# EAGLE design bbb_localization_cape (EAGLE 8.4.2)

## Sheet 1 of 3: Main
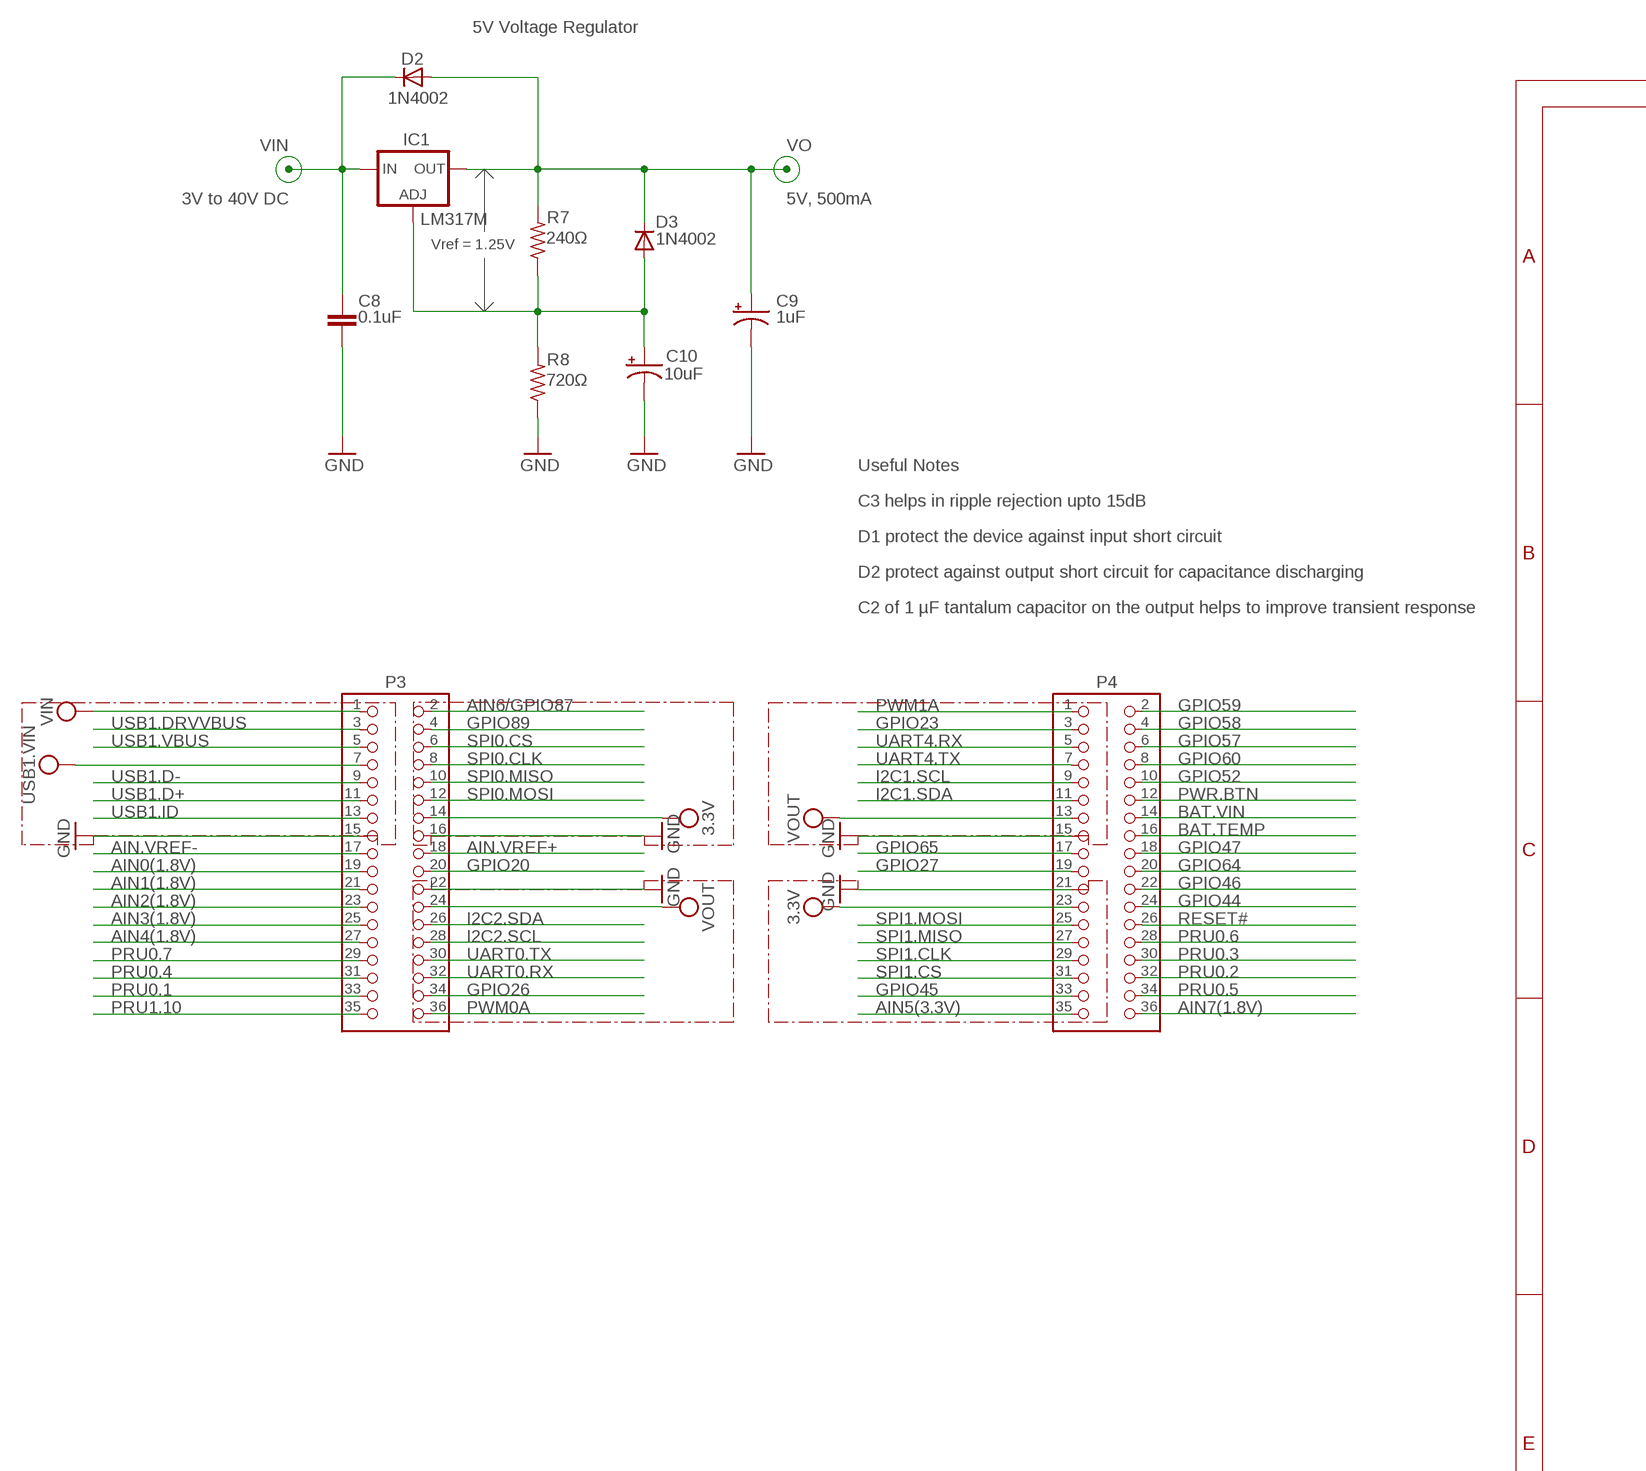
[diagram p0: schematic, sheet 1, part 1 of 2]
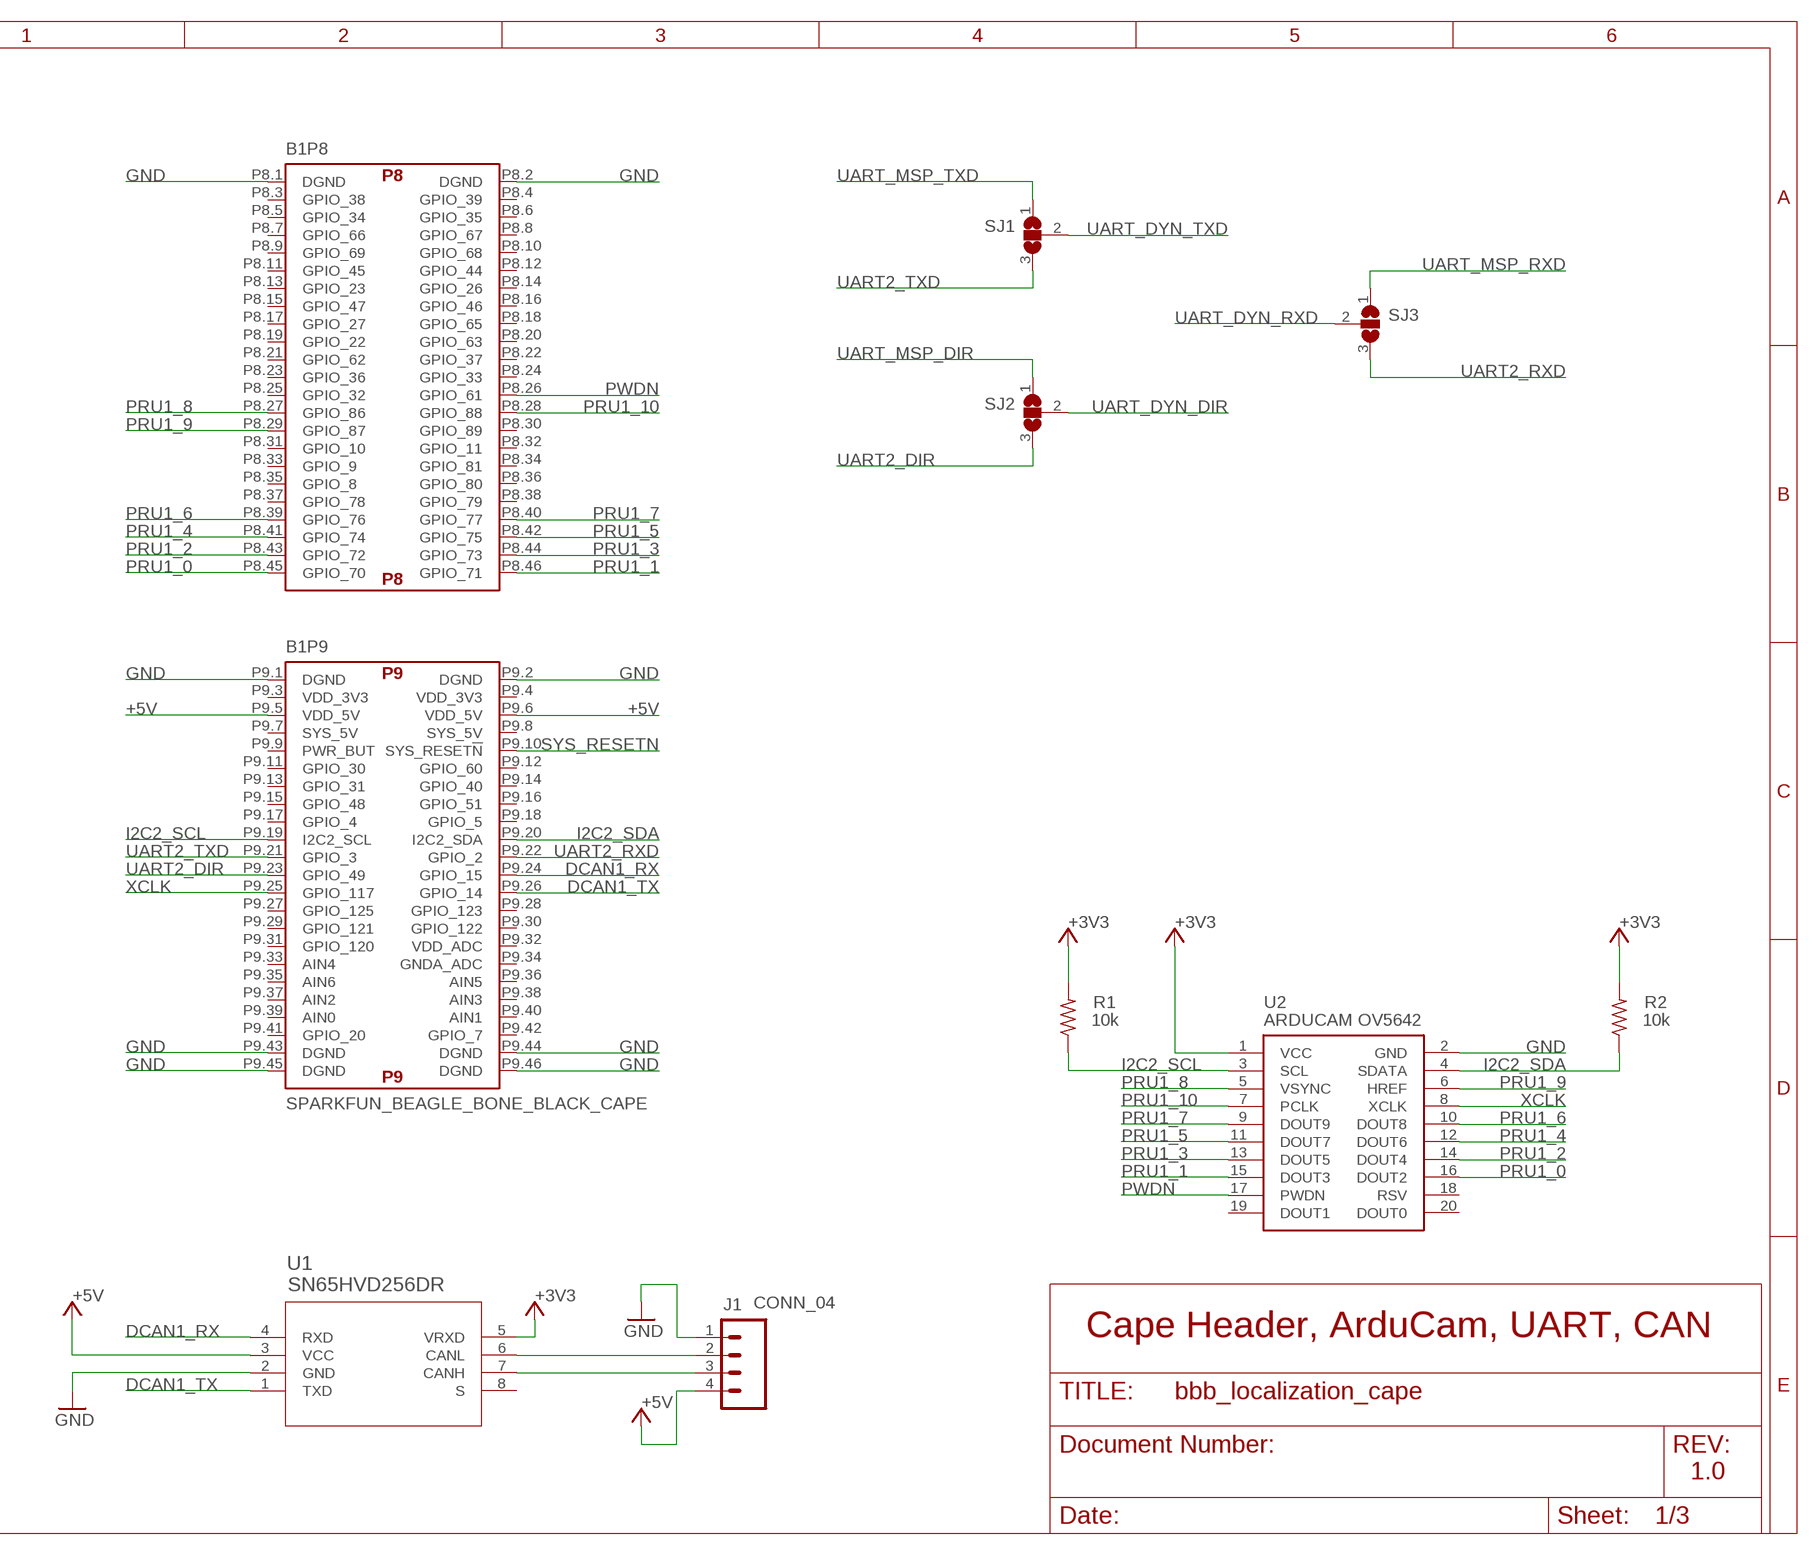
[diagram p1: schematic, sheet 1, part 2 of 2]

### Parts
B1  SPARKFUN_BEAGLE_BONE_BLACK_CAPE  [BEAGLE_BONE_BLACK_CAPE]
C8  0.1uF  C-EU075-052X106  [C075-052X106]
C9  1uF  CPOL-US085CS-1AR  [085CS_1AR]
C10  10uF  CPOL-US085CS-1AR  [085CS_1AR]
D2  1N4002  1N4004  [DO41-10]
D3  1N4002  1N4004  [DO41-10]
IC1  LM317MBSTT3  [SOT223]
J1  CONN_04  [JST-4-PTH-VERT]
P3  2X18-(INCH)-0.1-TH-(35MIL-DIA)-W/O-SILK  [TH-2X18-(35MIL-DIA)-W/O-SILK]
P4  2X18-(INCH)-0.1-TH-(35MIL-DIA)-W/O-SILK  [TH-2X18-(35MIL-DIA)-W/O-SILK]
R1  10k  R-US_R0805  [R0805]
R2  10k  R-US_R0805  [R0805]
R7  240Ω  R-US_M0805  [M0805]
R8  720Ω  R-US_M0805  [M0805]
SJ1  SJ2W  [SJ_2]
SJ2  SJ2W  [SJ_2]
SJ3  SJ2W  [SJ_2]
U1  SN65HVD256DR  [D8]
U2  ARDUCAMOV5642  [ARDUCAM]

### Nets
3.3V: P3.14 P4.23
+3V3: R1.2 R2.2 U1.5(VRXD) U2.1(VCC) ; also sheet 2,3
+5V: B1.P9.5(P9:VDD_5V) B1.P9.6(P9:VDD_5V) J1.4 U1.3(VCC) ; also sheet 2,3
AIN0(1.8V): P3.19
AIN1(1.8V): P3.21
AIN2(1.8V): P3.23
AIN3(1.8V): P3.25
AIN4(1.8V): P3.27
AIN5(3.3V): P4.35
AIN6/GPIO87: P3.2
AIN7(1.8V): P4.36
AIN.VREF+: P3.18
AIN.VREF-: P3.17
BAT.TEMP: P4.16
BAT.VIN: P4.14
DCAN1_RX: B1.P9.24(P9:GPIO_15) U1.4(RXD)
DCAN1_TX: B1.P9.26(P9:GPIO_14) U1.1(TXD)
GND: B1.P8.1(P8:DGND) B1.P8.2(P8:DGND) B1.P9.1(P9:DGND) B1.P9.2(P9:DGND) B1.P9.43(P9:DGND) B1.P9.44(P9:DGND) B1.P9.45(P9:DGND) B1.P9.46(P9:DGND) C8.2 C9.- C10.- J1.1 P3.15 P3.16 P3.22 P4.15 P4.21 R8.1 U1.2(GND) U2.2(GND) ; also sheet 2,3
GPIO20: P3.20
GPIO23: P4.3
GPIO26: P3.34
GPIO27: P4.19
GPIO44: P4.24
GPIO45: P4.33
GPIO46: P4.22
GPIO47: P4.18
GPIO52: P4.10
GPIO57: P4.6
GPIO58: P4.4
GPIO59: P4.2
GPIO60: P4.8
GPIO64: P4.20
GPIO65: P4.17
GPIO89: P3.4
I2C1.SCL: P4.9
I2C1.SDA: P4.11
I2C2.SCL: P3.28
I2C2.SDA: P3.26
I2C2_SCL [power]: B1.P9.19(P9:I2C2_SCL) R1.1 U2.3(SCL) ; also sheet 2
I2C2_SDA: B1.P9.20(P9:I2C2_SDA) R2.1 U2.4(SDATA) ; also sheet 2
N$1: J1.2 U1.6(CANL)
N$2: J1.3 U1.7(CANH)
N$5: C10.+ D3.A IC1.1(ADJ) R7.1 R8.2
PRU0.1: P3.33
PRU0.2: P4.32
PRU0.3: P4.30
PRU0.4: P3.31
PRU0.5: P4.34
PRU0.6: P4.28
PRU0.7: P3.29
PRU1.10: P3.35
PRU1_0 [power]: B1.P8.45(P8:GPIO_70) U2.16(DOUT2)
PRU1_1 [power]: B1.P8.46(P8:GPIO_71) U2.15(DOUT3)
PRU1_2 [power]: B1.P8.43(P8:GPIO_72) U2.14(DOUT4)
PRU1_3 [power]: B1.P8.44(P8:GPIO_73) U2.13(DOUT5)
PRU1_4 [power]: B1.P8.41(P8:GPIO_74) U2.12(DOUT6)
PRU1_5 [power]: B1.P8.42(P8:GPIO_75) U2.11(DOUT7)
PRU1_6 [power]: B1.P8.39(P8:GPIO_76) U2.10(DOUT8)
PRU1_7 [power]: B1.P8.40(P8:GPIO_77) U2.9(DOUT9)
PRU1_8 [power]: B1.P8.27(P8:GPIO_86) U2.5(VSYNC)
PRU1_9 [power]: B1.P8.29(P8:GPIO_87) U2.6(HREF)
PRU1_10 [power]: B1.P8.28(P8:GPIO_88) U2.7(PCLK)
PWDN: B1.P8.26(P8:GPIO_61) U2.17(PWDN)
PWM0A: P3.36
PWM1A: P4.1
PWR.BTN: P4.12
RESET#: P4.26
SPI0.CLK: P3.8
SPI0.CS: P3.6
SPI0.MISO: P3.10
SPI0.MOSI: P3.12
SPI1.CLK: P4.29
SPI1.CS: P4.31
SPI1.MISO: P4.27
SPI1.MOSI: P4.25
SYS_RESETN: B1.P9.10(P9:SYS_RESET!N) ; also sheet 3
UART0.RX: P3.32
UART0.TX: P3.30
UART2_DIR: B1.P9.23(P9:GPIO_49) SJ2.3
UART2_RXD: B1.P9.22(P9:GPIO_2) SJ3.3
UART2_TXD: B1.P9.21(P9:GPIO_3) SJ1.3
UART4.RX: P4.5
UART4.TX: P4.7
UART_DYN_DIR: SJ2.2 ; also sheet 2
UART_DYN_RXD: SJ3.2 ; also sheet 2
UART_DYN_TXD: SJ1.2 ; also sheet 2
UART_MSP_DIR: SJ2.1 ; also sheet 2
UART_MSP_RXD: SJ3.1 ; also sheet 2
UART_MSP_TXD: SJ1.1 ; also sheet 2
USB1.D+: P3.11
USB1.D-: P3.9
USB1.DRVVBUS: P3.3
USB1.ID: P3.13
USB1.VBUS: P3.5
VIN: C8.1 D2.C IC1.3(IN) P3.1
VIN.USB: P3.7 ; supply symbol labelled USB1.VIN
VO: C9.+ D2.A D3.C IC1.4(OUT) R7.2
VOUT: P3.24 P4.13
XCLK: B1.P9.25(P9:GPIO_117) U2.8(XCLK)
Unconnected: B1.P8.3(P8:GPIO_38) B1.P8.4(P8:GPIO_39) B1.P8.5(P8:GPIO_34) B1.P8.6(P8:GPIO_35) B1.P8.7(P8:GPIO_66) B1.P8.8(P8:GPIO_67) B1.P8.9(P8:GPIO_69) B1.P8.10(P8:GPIO_68) B1.P8.11(P8:GPIO_45) B1.P8.12(P8:GPIO_44) B1.P8.13(P8:GPIO_23) B1.P8.14(P8:GPIO_26) B1.P8.15(P8:GPIO_47) B1.P8.16(P8:GPIO_46) B1.P8.17(P8:GPIO_27) B1.P8.18(P8:GPIO_65) B1.P8.19(P8:GPIO_22) B1.P8.20(P8:GPIO_63) B1.P8.21(P8:GPIO_62) B1.P8.22(P8:GPIO_37) B1.P8.23(P8:GPIO_36) B1.P8.24(P8:GPIO_33) B1.P8.25(P8:GPIO_32) B1.P8.30(P8:GPIO_89) B1.P8.31(P8:GPIO_10) B1.P8.32(P8:GPIO_11) B1.P8.33(P8:GPIO_9) B1.P8.34(P8:GPIO_81) B1.P8.35(P8:GPIO_8) B1.P8.36(P8:GPIO_80) B1.P8.37(P8:GPIO_78) B1.P8.38(P8:GPIO_79) B1.P9.3(P9:VDD_3V3) B1.P9.4(P9:VDD_3V3) B1.P9.7(P9:SYS_5V) B1.P9.8(P9:SYS_5V) B1.P9.9(P9:PWR_BUT) B1.P9.11(P9:GPIO_30) B1.P9.12(P9:GPIO_60) B1.P9.13(P9:GPIO_31) B1.P9.14(P9:GPIO_40) B1.P9.15(P9:GPIO_48) B1.P9.16(P9:GPIO_51) B1.P9.17(P9:GPIO_4) B1.P9.18(P9:GPIO_5) B1.P9.27(P9:GPIO_125) B1.P9.28(P9:GPIO_123) B1.P9.29(P9:GPIO_121) B1.P9.30(P9:GPIO_122) B1.P9.31(P9:GPIO_120) B1.P9.32(P9:VDD_ADC) B1.P9.33(P9:AIN4) B1.P9.34(P9:GNDA_ADC) B1.P9.35(P9:AIN6) B1.P9.36(P9:AIN5) B1.P9.37(P9:AIN2) B1.P9.38(P9:AIN3) B1.P9.39(P9:AIN0) B1.P9.40(P9:AIN1) B1.P9.41(P9:GPIO_20) B1.P9.42(P9:GPIO_7) U1.8(S) U2.18(RSV) U2.19(DOUT1) U2.20(DOUT0)

### Notes on the sheet
- 5V Voltage Regulator
- 3V to 40V DC | 5V, 500mA
- Vref = 1.25V
- Useful Notes
- C3 helps in ripple rejection upto 15dB
- D1 protect the device against input short circuit
- D2 protect against output short circuit for capacitance discharging
- C2 of 1 µF tantalum capacitor on the output helps to improve transient response
- Cape Header, ArduCam, UART, CAN
- 1.0

## Sheet 2 of 3: MSP430
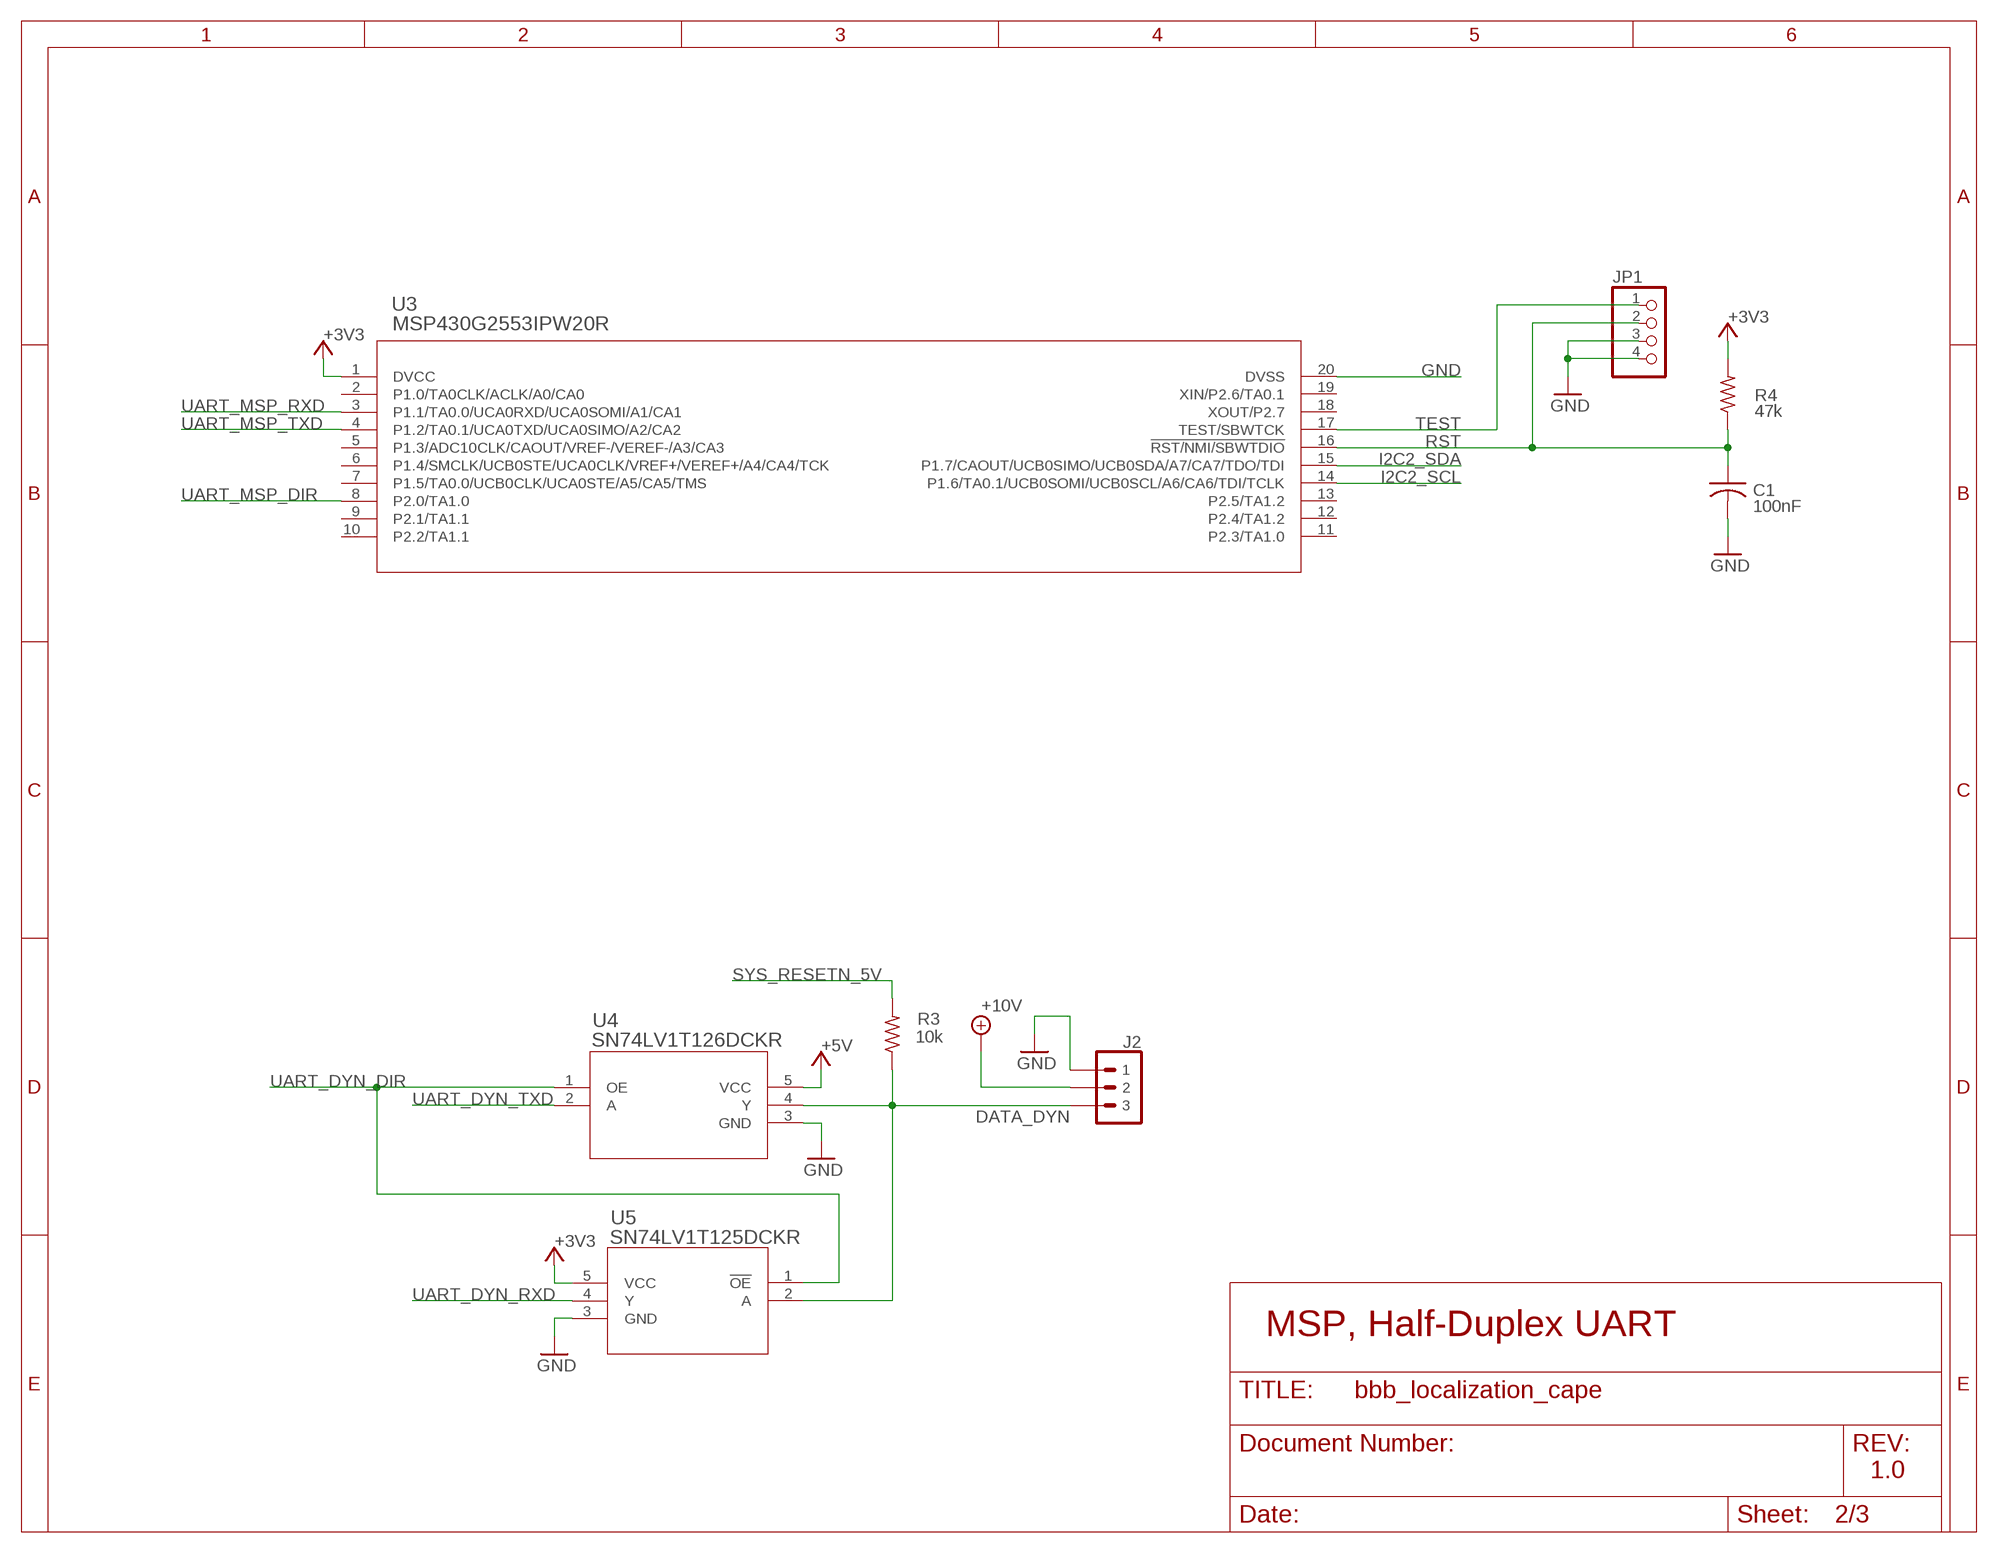
[diagram p2: schematic, sheet 2]

### Parts
C1  100nF  C-USC0805  [C0805]
J2  MOLEX-22-03-5035  [MOLEX-22-03-5035]
JP1  PINHD-1X4  [1X04]
R3  10k  R-US_R0805  [R0805]
R4  47k  R-US_R0805  [R0805]
U3  MSP430G2553IPW20R  [PW20]
U4  SN74LV1T126DCKR  [DCK5]
U5  SN74LV1T125DCKR  [DCK5]

### Nets
+3V3: R4.2 U3.1(DVCC) U5.5(VCC) ; also sheet 1,3
+5V: U4.5(VCC) ; also sheet 1,3
+10V: J2.P$2 ; also sheet 3
DATA_DYN: J2.P$3 R3.1 U4.4(Y) U5.2(A)
GND: C1.2 J2.P$1 JP1.3 JP1.4 U3.20(DVSS) U4.3(GND) U5.3(GND) ; also sheet 1,3
I2C2_SCL [power]: U3.14(P1.6/TA0.1/UCB0SOMI/UCB0SCL/A6/CA6/TDI/TCLK) ; also sheet 1
I2C2_SDA: U3.15(P1.7/CAOUT/UCB0SIMO/UCB0SDA/A7/CA7/TDO/TDI) ; also sheet 1
RST: C1.1 JP1.2 R4.1 U3.16(!RST/NMI/SBWTDIO)
SYS_RESETN_5V: R3.2 ; also sheet 3
TEST: JP1.1 U3.17(TEST/SBWTCK)
UART_DYN_DIR: U4.1(OE) U5.1(!OE) ; also sheet 1
UART_DYN_RXD: U5.4(Y) ; also sheet 1
UART_DYN_TXD: U4.2(A) ; also sheet 1
UART_MSP_DIR: U3.8(P2.0/TA1.0) ; also sheet 1
UART_MSP_RXD: U3.3(P1.1/TA0.0/UCA0RXD/UCA0SOMI/A1/CA1) ; also sheet 1
UART_MSP_TXD: U3.4(P1.2/TA0.1/UCA0TXD/UCA0SIMO/A2/CA2) ; also sheet 1
Unconnected: U3.2(P1.0/TA0CLK/ACLK/A0/CA0) U3.5(P1.3/ADC10CLK/CAOUT/VREF-/VEREF-/A3/CA3) U3.6(P1.4/SMCLK/UCB0STE/UCA0CLK/VREF+/VEREF+/A4/CA4/TCK) U3.7(P1.5/TA0.0/UCB0CLK/UCA0STE/A5/CA5/TMS) U3.9(P2.1/TA1.1) U3.10(P2.2/TA1.1) U3.11(P2.3/TA1.0) U3.12(P2.4/TA1.2) U3.13(P2.5/TA1.2) U3.18(XOUT/P2.7) U3.19(XIN/P2.6/TA0.1)

### Notes on the sheet
- MSP, Half-Duplex UART
- 1.0

## Sheet 3 of 3: DC/DC Converters
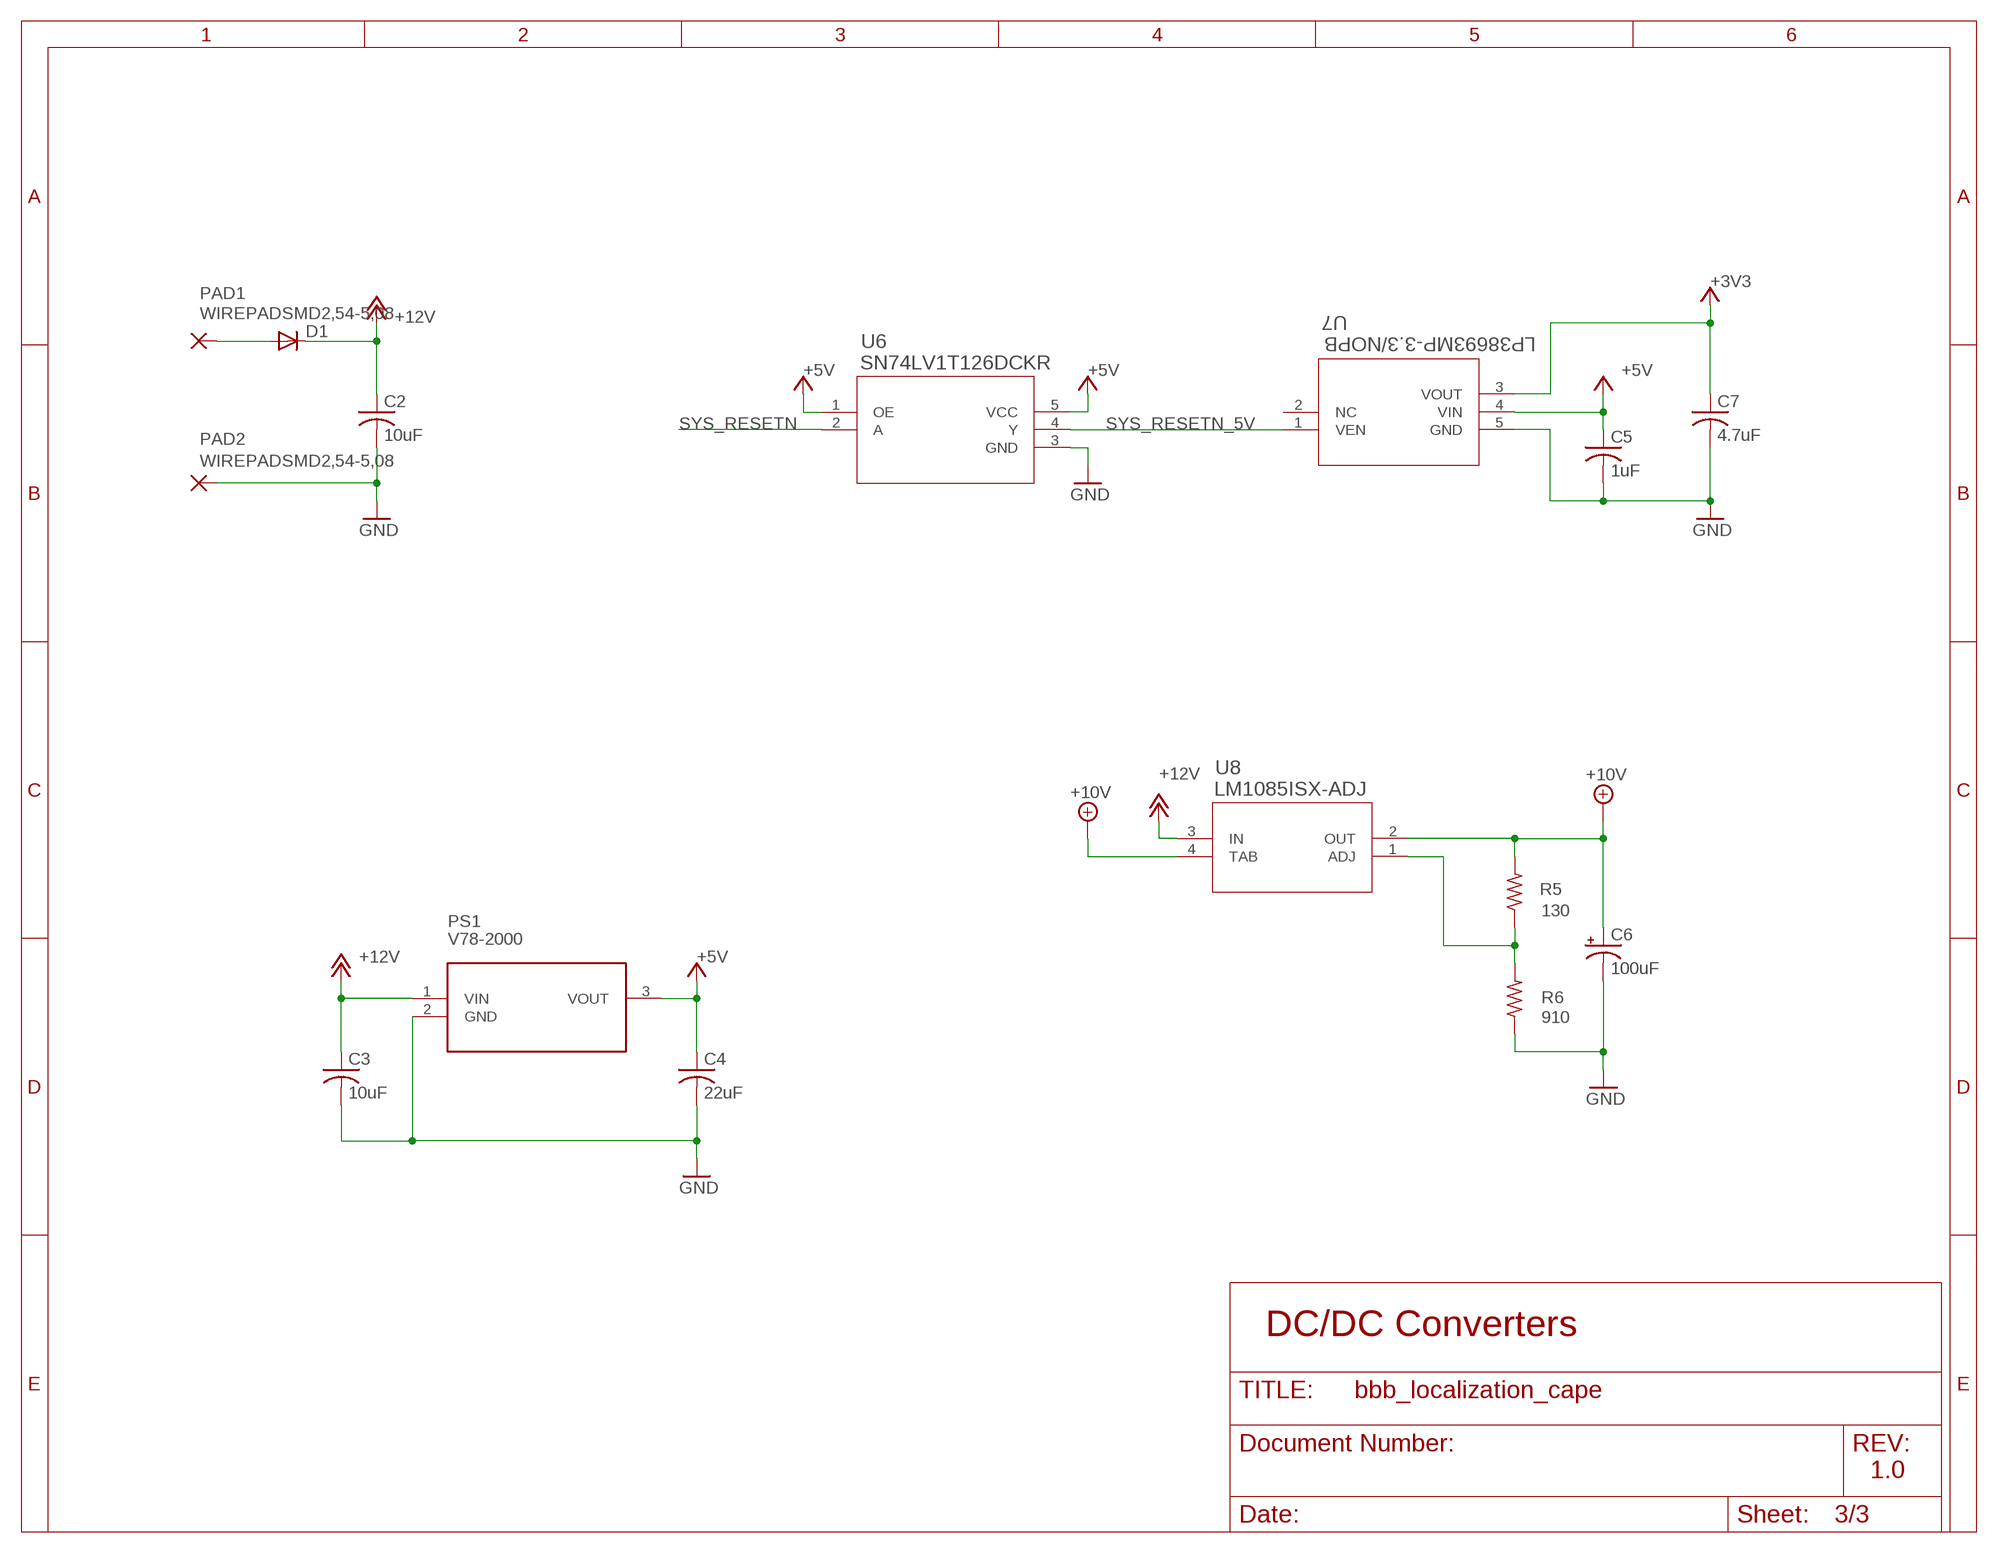
[diagram p3: schematic, sheet 3]

### Parts
C2  10uF  C-USC0805  [C0805]
C3  10uF  C-USC0805  [C0805]
C4  22uF  C-USC0805  [C0805]
C5  1uF  C-USC0805  [C0805]
C6  100uF  CAP_PANASONIC_E  [PANASONIC_E]
C7  4.7uF  C-USC0805  [C0805]
D1  DIODE-DO-214AC  [DO-214AC]
PAD1  WIREPADSMD2,54-5,08  [SMD2,54-5,08]
PAD2  WIREPADSMD2,54-5,08  [SMD2,54-5,08]
PS1  V78-2000  [V78-2000]
R5  130  R-US_R0805  [R0805]
R6  910  R-US_R0805  [R0805]
U6  SN74LV1T126DCKR  [DCK5]
U7  LP38693MP-3.3/NOPB  [MP05A]
U8  LM1085ISX-ADJ  [TS3B]

### Nets
+3V3: C7.1 U7.3(VOUT) ; also sheet 1,2
+5V: C4.1 C5.1 PS1.3(VOUT) U6.1(OE) U6.5(VCC) U7.4(VIN) ; also sheet 1,2
+10V: C6.+ R5.2 U8.2(OUT) U8.4(TAB) ; also sheet 2
+12V: C2.1 C3.1 D1.C PS1.1(VIN) U8.3(IN)
GND: C2.2 C3.2 C4.2 C5.2 C6.- C7.2 PAD2.1(P) PS1.2(GND) R6.1 U6.3(GND) U7.5(GND) ; also sheet 1,2
N$3: R5.1 R6.2 U8.1(ADJ)
N$4: D1.A PAD1.1(P)
SYS_RESETN: U6.2(A) ; also sheet 1
SYS_RESETN_5V: U6.4(Y) U7.1(VEN) ; also sheet 2
Unconnected: U7.2(NC)

### Notes on the sheet
- DC/DC Converters
- 1.0

## Library data of the parts
B1 = bbb_localization_cape:SPARKFUN_BEAGLE_BONE_BLACK_CAPE: BeagleBone Black Rev C Cape Generic footprint for BeagleBone Black Rev C Capes. SparkFun Products: SparkFun BeagleBone Black Proto Cape <https://www.sparkfun.com/products/12774> SparkFun CryptoCape <https://www.sparkfun.com/products/12773>
C1 = rcl:C-US: CAPACITOR, American symbol; MANUFACTURER: Samsung Electro-Mechanics America, Inc.; MANUFACTURER_PART_NUMBER: CL21B104KOANNNC; PN: 1276-2448-1-ND; VENDOR: Digi-Key
C2 C3 = rcl:C-US: CAPACITOR, American symbol; MANUFACTURER: Murata Electronics North America; MANUFACTURER_PART_NUMBER: GRM21BR61E106MA73L; PN: 490-10748-1-ND; VENDOR: Digi-Key
C4 = rcl:C-US: CAPACITOR, American symbol; MANUFACTURER: Samsung Electro-Mechanics America, Inc.; MANUFACTURER_PART_NUMBER: CL21A226MOCLRNC; PN: 1276-6780-1-ND; VENDOR: Dig-Key
C5 = rcl:C-US: CAPACITOR, American symbol; MANUFACTURER: Samsung Electro-Mechanics America, Inc.; MANUFACTURER_PART_NUMBER: CL21B105KPFNNNE; PN: 1276-1275-1-ND; VENDOR: Digi-Key
C6 = bbb_localization_cape:CAP; MANUFACTURER: TDK Corporation; MANUFACTURER_PART_NUMBER: C3216X5R1E476M160AC; NOTES: Reduced capacitance from 100uF to 47uF, V2 package should be 1210 or larger; PN: 445-8047-1-ND; SPICEPREFIX: C; VENDOR: Digi-Key
C7 = rcl:C-US: CAPACITOR, American symbol; MANUFACTURER: Samsung Electro-Mechanics America, Inc.; MANUFACTURER_PART_NUMBER: CL21A475KQFNNNG; PN: 1276-6465-1-ND; VENDOR: Digi-Key
C8 = rcl:C-EU: CAPACITOR, European symbol
C9 C10 = resistor:CPOL-US: POLARIZED CAPACITOR, American symbol
D1 = diode:DIODE-: DIODE
D2 D3 = diode:1N4004: DIODE general purpose rectifier, 1 A
IC1 = v-reg:LM317?*: 500 mA Adjustable Output Positive Voltage Regulator Source: http://www.onsemi.co.jp .. LM317M-D.PDF; PARTNUMBER: LM317M
J1 = bbb_localization_cape:CONN_04; MANUFACTURER: JST Sales America Inc.; MANUFACTURER_PART_NUMBER: B4B-PH-K-S(LF)(SN); PN: 455-1706-ND; VENDOR: Digi-Key
J2 = bbb_localization_cape:MOLEX-22-03-5035: MOLEX, LLC 22-03-5035; MANUFACTURER: Molex, LLC; MANUFACTURER_PART_NUMBER: 22-03-5035; PN: WM18887-ND; VENDOR: Digi-Key
JP1 = pinhead:PINHD-1X4: PIN HEADER; MANUFACTURER: Samtec Inc.; MANUFACTURER_PART_NUMBER: SSW-104-01-F-S; PN: SAM10018-ND; VENDOR: Digi-Key
P3 P4 = GHI-Headers:2X18-(INCH)-0.1-
PAD1 PAD2 = bbb_localization_cape:WIREPAD: Wire PAD connect wire on PCB; VENDOR: OSH Park
PS1 = bbb_localization_cape:V78-2000: 5V Non-Isolated Switching Regulator; MANUFACTURER: CUI Inc.; MANUFACTURER_PART_NUMBER: V7805-2000R; PN: 102-2188-ND; VENDOR: Digi-Key
R1-R3 = rcl:R-US_: RESISTOR, American symbol; MANUFACTURER: Yageo; MANUFACTURER_PART_NUMBER: RC0805JR-0710KL; PN: 311-10KARCT-ND; VENDOR: Digi-Key
R4 = rcl:R-US_: RESISTOR, American symbol; MANUFACTURER: Stackpole Electronics Inc; MANUFACTURER_PART_NUMBER: RMCF0805JT47K0; PN: RMCF0805JT47K0CT-ND; VENDOR: Digi-Key
R5 = rcl:R-US_: RESISTOR, American symbol; MANUFACTURER: Yageo; MANUFACTURER_PART_NUMBER: RC0805FR-07130RL; PN: 311-130CRCT-ND; VENDOR: Digi-Key
R6 = rcl:R-US_: RESISTOR, American symbol; MANUFACTURER: Yageo; MANUFACTURER_PART_NUMBER: RC0805FR-07910RL; PN: 311-910CRCT-ND; VENDOR: Digi-Key
R7 R8 = resistor:R-US_: RESISTOR, American symbol
SJ1-SJ3 = bbb_localization_cape:SJ2W: SMD solder JUMPER; VENDOR: OSH Park
U1 = bbb_localization_cape:SN65HVD256DR: CAN Transciever; MANUFACTURER: Texas Instruments; MANUFACTURER_PART_NUMBER: SN65HVD256DR; PN: 296-30093-1-ND; VENDOR: Digi-Key
U2 = bbb_localization_cape:ARDUCAM: ArduCAM OV5642; MANUFACTURER: Samtec Inc.; MANUFACTURER_PART_NUMBER: SSW-110-02-L-D; NOTES: 20 pin header; PN: SAM11952-ND; VENDOR: Digi-Key
U3 = bbb_localization_cape:MSP430G2553IPW20R: Microcontroller; MANUFACTURER: Texas Instruments; MANUFACTURER_PART_NUMBER: MSP430G2553IPW20R; NOTES: ECE stocks a different version; PN: 296-28430-1-ND; VENDOR: Digi-Key
U4 U6 = bbb_localization_cape:SN74LV1T126DCKR: 3-State Output Level Shifter (High OE); MANUFACTURER: Texas Instruments; MANUFACTURER_PART_NUMBER: SN74LV1T126DCKR; PN: 296-37175-1-ND; VENDOR: Digi-Key
U5 = bbb_localization_cape:SN74LV1T125DCKR: 3-State Output Level Shifter (Low OE); MANUFACTURER: Texas Instruments; MANUFACTURER_PART_NUMBER: SN74LV1T125DCKR; PN: 296-37173-1-ND; VENDOR: Digi-Key
U7 = bbb_localization_cape:LP38693MP-3.3/NOPB: 3.3V Linear Voltage Regulator; MANUFACTURER: Texas Instruments; MANUFACTURER_PART_NUMBER: LP38693MP-3.3/NOPB; PN: LP38693MP-3.3/NOPBCT-ND; VENDOR: Digi-Key
U8 = bbb_localization_cape:LM1085ISX-ADJ: Adjustable Linear Voltage Regulator; MANUFACTURER: Texas Instruments; MANUFACTURER_PART_NUMBER: LM1085ISX-ADJ/NOPB; PN: LM1085ISX-ADJ/NOPBCT-ND; VENDOR: Digi-Key

## Board
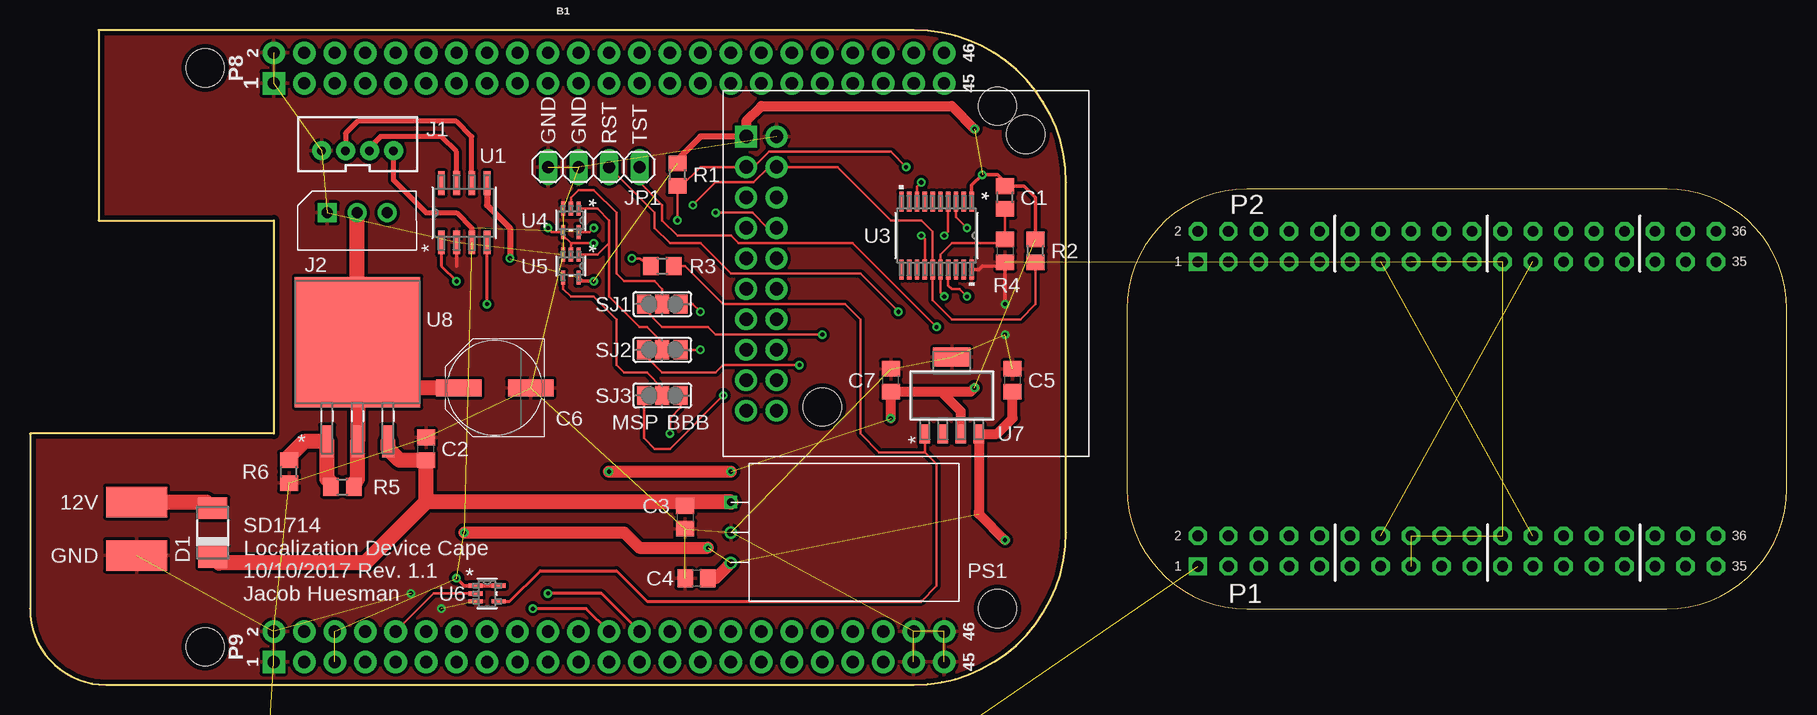
[diagram p4: board, top side]
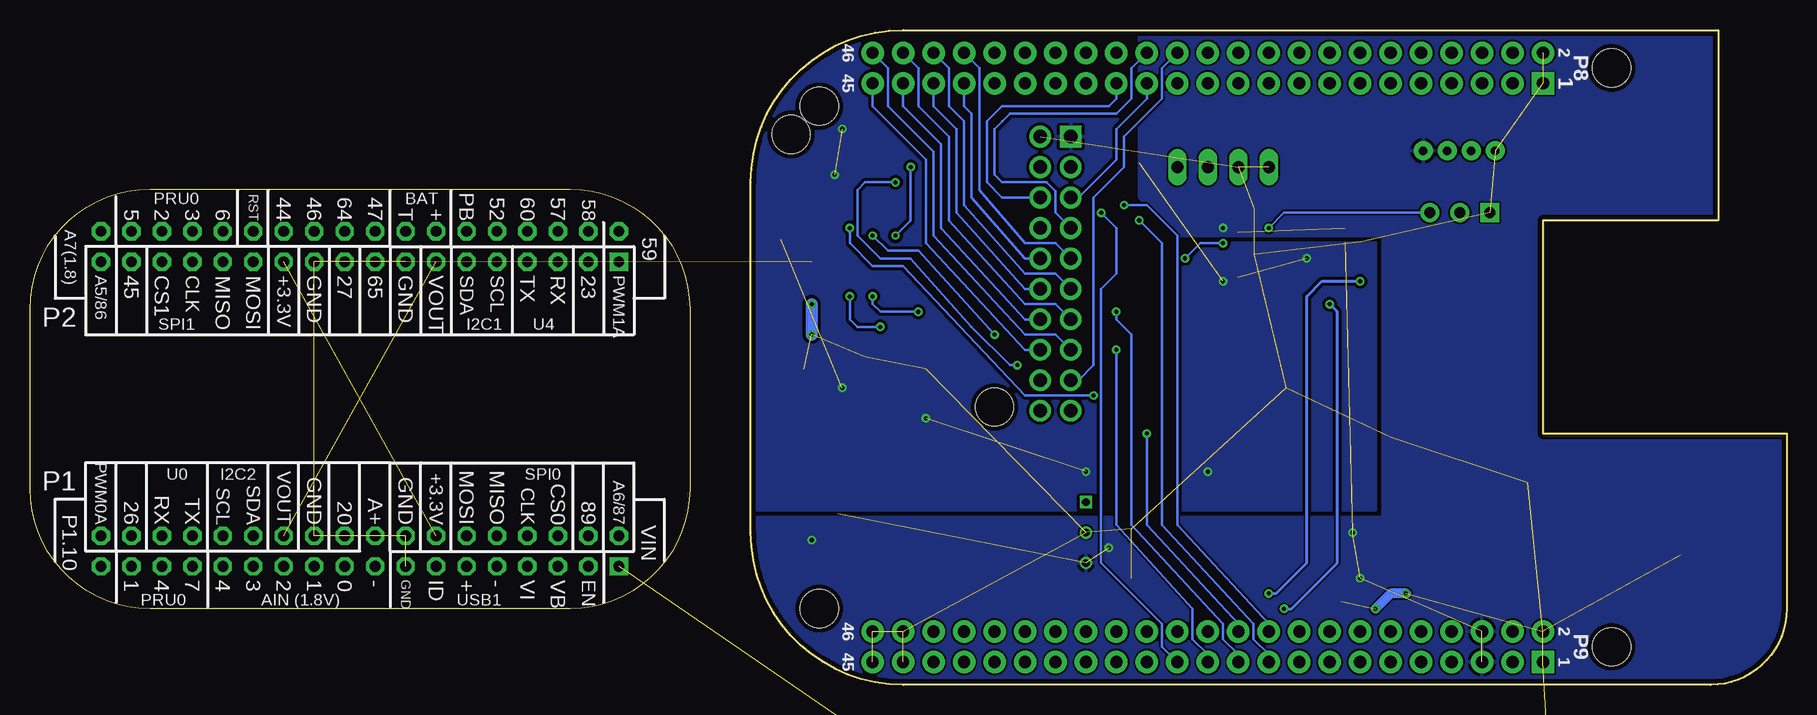
[diagram p5: board, bottom side, seen from below]

Size 146.44 x 54.61 mm. Coordinates in mm from the lower left corner, seen from the top.
Outline: 5.71,54.61 5.71,38.73 20.32,38.73 20.32,20.95 0,20.95 0,6.35 arc90 6.35,0 73.66,0 arc90 86.36,12.7 86.36,41.91 arc90 73.66,54.61 5.71,54.61
Outline: 136.44,41.35 101.44,41.35 arc90 91.44,31.35 91.44,16.35 arc90 101.44,6.35 136.44,6.35 arc90 146.44,16.35 146.44,31.35 arc90 136.44,41.35
Copper layers (1*16): Top 0.0356mm / dielectric 1.5011mm / Bottom 0.0356mm
Design rules "oshpark-2layer": minimum track width 6mil, minimum drill 13mil, track to track 6mil, track to pad 6mil, pad to pad 6mil, via to via 6mil, smd to smd 6mil, copper to edge 15mil, drill to drill 6mil, minimum pad ring 7mil, minimum via ring 7mil, stop-mask expansion 2.5mil, vias tented up to drill 0mil, thermal gap 10mil

### Footprints (pad centres in the part's own frame; a part is rotated, then mirrored left to right if it is on the bottom)
BEAGLE_BONE_BLACK_CAPE = drill 1.016 pad 1.88 square: P8.1 -24.13,20.955; P9.1 -24.13,-27.305 | drill 1.016 pad 1.88: P8.2 -24.13,23.495; P8.3 -21.59,20.955; P8.4 -21.59,23.495; P8.5 -19.05,20.955; P8.6 -19.05,23.495; P8.7 -16.51,20.955; P8.8 -16.51,23.495; P8.9 -13.97,20.955; P8.10 -13.97,23.495; P8.11 -11.43,20.955; P8.12 -11.43,23.495; P8.13 -8.89,20.955; P8.14 -8.89,23.495; P8.15 -6.35,20.955; P8.16 -6.35,23.495; P8.17 -3.81,20.955; P8.18 -3.81,23.495; P8.19 -1.27,20.955; P8.20 -1.27,23.495; P8.21 1.27,20.955; P8.22 1.27,23.495; P8.23 3.81,20.955; P8.24 3.81,23.495; P8.25 6.35,20.955; P8.26 6.35,23.495; P8.27 8.89,20.955; P8.28 8.89,23.495; P8.29 11.43,20.955; P8.30 11.43,23.495; P8.31 13.97,20.955; P8.32 13.97,23.495; P8.33 16.51,20.955; P8.34 16.51,23.495; P8.35 19.05,20.955; P8.36 19.05,23.495; P8.37 21.59,20.955; P8.38 21.59,23.495; P8.39 24.13,20.955; P8.40 24.13,23.495; P8.41 26.67,20.955; P8.42 26.67,23.495; P8.43 29.21,20.955; P8.44 29.21,23.495; P8.45 31.75,20.955; P8.46 31.75,23.495; P9.2 -24.13,-24.765; P9.3 -21.59,-27.305; P9.4 -21.59,-24.765; P9.5 -19.05,-27.305; P9.6 -19.05,-24.765; P9.7 -16.51,-27.305; P9.8 -16.51,-24.765; P9.9 -13.97,-27.305; P9.10 -13.97,-24.765; P9.11 -11.43,-27.305; P9.12 -11.43,-24.765; P9.13 -8.89,-27.305; P9.14 -8.89,-24.765; P9.15 -6.35,-27.305; P9.16 -6.35,-24.765; P9.17 -3.81,-27.305; P9.18 -3.81,-24.765; P9.19 -1.27,-27.305; P9.20 -1.27,-24.765; P9.21 1.27,-27.305; P9.22 1.27,-24.765; P9.23 3.81,-27.305; P9.24 3.81,-24.765; P9.25 6.35,-27.305; P9.26 6.35,-24.765; P9.27 8.89,-27.305; P9.28 8.89,-24.765; P9.29 11.43,-27.305; P9.30 11.43,-24.765; P9.31 13.97,-27.305; P9.32 13.97,-24.765; P9.33 16.51,-27.305; P9.34 16.51,-24.765; P9.35 19.05,-27.305; P9.36 19.05,-24.765; P9.37 21.59,-27.305; P9.38 21.59,-24.765; P9.39 24.13,-27.305; P9.40 24.13,-24.765; P9.41 26.67,-27.305; P9.42 26.67,-24.765; P9.43 29.21,-27.305; P9.44 29.21,-24.765; P9.45 31.75,-27.305; P9.46 31.75,-24.765 | hole 3.175: -29.845,-26.035; 36.195,-22.86; 36.195,19.05; -29.845,22.225
C0805 = smd 1.3 x 1.5: 1 -0.95,0; 2 0.95,0
PANASONIC_E = smd 3.8 x 1.4: + 3,0; - -3,0
C075-052X106 = drill 0.914 octagon: 1 -3.81,0; 2 3.81,0
085CS_1AR = smd 2.9 x 2.5: + 3.25,0; - -3.25,0
DO-214AC = smd 1.8 x 2.4: A 2.025,0; C -2.025,0
DO41-10 = drill 1.118: A 5.08,0; C -5.08,0
SOT223 = smd 1.5 x 2: 1 -2.3,-3.15; 2 0,-3.15; 3 2.3,-3.15 | smd 3.8 x 2: 4 0,3.15
JST-4-PTH-VERT = drill 0.7 pad 1.6: 1 -3,-0.55; 2 -1,-0.55; 3 1,-0.55; 4 3,-0.55
MOLEX-22-03-5035 = drill 0.9 pad 1.6 square: P$1 0,0 | drill 0.9 pad 1.6: P$2 2.5,0; P$3 5,0
1X04 = drill 1.016 long: 1 -3.81,0; 2 -1.27,0; 3 1.27,0; 4 3.81,0
TH-2X18-(35MIL-DIA)-W/O-SILK = drill 0.889 pad 1.524 square: 1 -21.59,-1.27 | drill 0.889 pad 1.524 octagon: 2 -21.59,1.27; 3 -19.05,-1.27; 4 -19.05,1.27; 5 -16.51,-1.27; 6 -16.51,1.27; 7 -13.97,-1.27; 8 -13.97,1.27; 9 -11.43,-1.27; 10 -11.43,1.27; 11 -8.89,-1.27; 12 -8.89,1.27; 13 -6.35,-1.27; 14 -6.35,1.27; 15 -3.81,-1.27; 16 -3.81,1.27; 17 -1.27,-1.27; 18 -1.27,1.27; 19 1.27,-1.27; 20 1.27,1.27; 21 3.81,-1.27; 22 3.81,1.27; 23 6.35,-1.27; 24 6.35,1.27; 25 8.89,-1.27; 26 8.89,1.27; 27 11.43,-1.27; 28 11.43,1.27; 29 13.97,-1.27; 30 13.97,1.27; 31 16.51,-1.27; 32 16.51,1.27; 33 19.05,-1.27; 34 19.05,1.27; 35 21.59,-1.27; 36 21.59,1.27
SMD2,54-5,08 = smd 2.54 x 5.08: 1 0,0
V78-2000 = drill 0.65 pad 1.016 square: 1 -2.54,0 | drill 0.65 pad 1.016: 2 0,0; 3 2.54,0
R0805 = smd 1.3 x 1.5: 1 -0.95,0; 2 0.95,0
M0805 = smd 1.3 x 1.6: 1 -0.95,0; 2 0.95,0
SJ_2 = smd 1.168 x 1.6: 1 -1.524,0; 2 0,0; 3 1.524,0
D8 = smd 1.981 x 0.559: 1 -2.464,1.905; 2 -2.464,0.635; 3 -2.464,-0.635; 4 -2.464,-1.905; 5 2.464,-1.905; 6 2.464,-0.635; 7 2.464,0.635; 8 2.464,1.905
ARDUCAM = drill 1.12 pad 1.82 square: 1 0,0 | drill 1.12 pad 1.82: 2 0,2.54; 3 2.54,0; 4 2.54,2.54; 5 5.08,0; 6 5.08,2.54; 7 7.62,0; 8 7.62,2.54; 9 10.16,0; 10 10.16,2.54; 11 12.7,0; 12 12.7,2.54; 13 15.24,0; 14 15.24,2.54; 15 17.78,0; 16 17.78,2.54; 17 20.32,0; 18 20.32,2.54; 19 22.86,0; 20 22.86,2.54 | hole 3.175: 22.543,6.35; -0.191,23.305
PW20 = smd 1.676 x 0.356: 1 -2.819,2.925; 2 -2.819,2.275; 3 -2.819,1.625; 4 -2.819,0.975; 5 -2.819,0.325; 6 -2.819,-0.325; 7 -2.819,-0.975; 8 -2.819,-1.625; 9 -2.819,-2.275; 10 -2.819,-2.925; 11 2.819,-2.925; 12 2.819,-2.275; 13 2.819,-1.625; 14 2.819,-0.975; 15 2.819,-0.325; 16 2.819,0.325; 17 2.819,0.975; 18 2.819,1.625; 19 2.819,2.275; 20 2.819,2.925
DCK5 = smd 1.168 x 0.356: 1 -0.965,0.65; 2 -0.965,0; 3 -0.965,-0.65; 4 0.965,-0.65; 5 0.965,0.65
MP05A = smd 1.6 x 0.838: 1 -3.2,2.25; 2 -3.2,0.75; 3 -3.2,-0.75; 4 -3.2,-2.25 | smd 1.6 x 3.099: 5 3.2,0
TS3B = smd 1.016 x 2.692: 1 -2.54,-8.28; 2 0,-8.28; 3 2.54,-8.28 | smd 10.465 x 10.871: 4 0,0

### Placement (x,y rotation side)
B1  44.45,29.21 0 top
C1  81.28,36.2 270 top
C2  33.02,19.68 90 top
C3  54.61,13.97 270 top
C4  55.56,8.89 180 top
C5  81.92,25.4 90 top
C6  38.73,24.77 180 top
C7  71.75,25.4 90 top
C8  11.43,-83.82 0 top  (outside the outline)
C9  8.89,-95.25 0 top  (outside the outline)
C10  25.4,-95.25 0 top  (outside the outline)
D1  15.24,12.7 90 top
D2  13.97,-50.8 0 top  (outside the outline)
D3  13.97,-68.58 0 top  (outside the outline)
IC1  29.21,-81.28 0 top  (outside the outline)
J1  27.3,45.09 0 top
J2  24.77,39.37 0 top
JP1  46.99,43.18 180 top
P3  118.94,11.15 0 top
P4  118.94,36.55 0 top
PAD1  8.89,15.24 270 top
PAD2  8.89,10.79 270 top
PS1  58.42,12.7 270 top
R1  53.98,42.55 90 top
R2  83.82,36.2 90 top
R3  52.7,34.92 0 top
R4  81.28,40.64 90 top
R5  26.04,16.51 0 top
R6  21.59,17.78 90 top
R7  35.56,-93.98 0 top  (outside the outline)
R8  2.54,-102.87 0 top  (outside the outline)
SJ1  52.7,31.75 0 top
SJ2  52.7,27.94 0 top
SJ3  52.7,24.13 0 top
U1  36.2,39.37 90 top
U2  59.69,45.72 270 top
U3  75.56,37.47 270 top
U4  45.09,38.73 270 top
U5  45.09,34.92 270 top
U6  38.1,7.62 0 top
U7  76.83,24.13 90 top
U8  27.3,28.57 0 top

### Tracks (layer width: path | path; a pad name or v marks a point on that pad's centre or on a via)
3.3V  (1 unrouted)
+3V3  (via drill 0.35)  (5 unrouted)
  Top 0.305: 53.98,43.81 R1.2 | v46.99,33.66 46.04,33.66 U5.5 | U3.1 78.49,41.66 v79.38,42.55 80.64,42.55 81.28,41.91 R4.2 82.87,41.59 83.82,40.64 R2.2
  Top 0.508: C7.1 71.44,24.77 | U1.5 38.1,40.01 40.01,38.1 v40.01,35.56 | U2.1 55.88,45.72 53.98,43.81
  Top 0.813: U7.3 77.57,22.84 75.96,24.45 | v71.75,22.23 C7.1 75.96,24.45 | U2.1 59.69,46.99 60.96,48.26 76.83,48.26 v78.74,46.35 | 75.96,24.45 78.42,24.45 v78.74,24.77
  Top 1.016: v48.26,17.78 v58.42,17.78
  pour Bottom (isolate 0.254, rank 2): 54.61,54.61 73.66,54.61 arc-90 86.36,41.91 86.36,14.61 34.29,14.61 34.29,36.83 50.8,36.83 54.61,40.64
+5V  (via drill 0.35)  (7 unrouted)
  Top 0.203: U4.5 46.66,37.77 v46.99,38.1
  Top 0.305: U6.5 U6.1 36.18,8.27 v35.56,8.89
  Top 0.406: U1.3 36.83,38.1 35.56,39.37 33.02,39.37 30.3,42.09 J1.4
  Top 0.813: C5.1 81.92,22.23 80.62,20.93 U7.4 79.1,14.43 79.1,14.25 v81.28,12.06
  Top 1.016: v36.2,12.7 49.53,12.7 50.8,11.43 v56.52,11.43 | C4.1 57.15,8.89 PS1.3
  pour Bottom: 86.36,13.97 86.36,12.7 arc-90 73.66,0 6.35,0 arc-90 0,6.35 0,20.95 20.32,20.95 20.32,38.73 5.71,38.73 5.71,54.61 53.98,54.61 53.98,40.64 50.8,37.47 33.66,37.47 33.66,13.97
+10V
  Top 1.27: R5.2 26.98,16.82 27.3,17.14 U8.2 U8.4 | U8.4 27.3,27.94 30.48,24.77 | J2.P$2 27.27,28.61 U8.4 | C6.+ 31.11,24.77 U8.4
+12V
  Top 1.27: 54.04,15.24 33.02,15.24 | 54.04,15.24 C3.1 | PS1.1 54.04,15.24 | 33.02,15.24 C2.1 30.8,18.73 29.84,19.68 U8.3 | D1.C 15.76,10.16 27.94,10.16 33.02,15.24
DATA_DYN  (via drill 0.35)
  Top 0.203: 45.09,36.83 44.44,37.48 U4.4 43.48,37.77 v43.18,38.1 | 45.09,36.83 U5.2 | 45.09,36.83 v46.99,36.83 | R3.1 50.8,35.56 v50.16,35.56
  Bottom 0.203: J2.P$3 41.91,39.37 v43.18,38.1 | v50.16,35.56 48.9,36.83 v46.99,36.83
DCAN1_RX  (via drill 0.35)
  Top 0.254: B1.P9.24 46.35,6.35 v41.91,6.35 | v38.1,31.75 U1.4
  Bottom 0.254: v41.91,6.35 41.27,6.35 37.47,10.16 37.47,31.11 v38.1,31.75
DCAN1_TX  (via drill 0.35)
  Top 0.254: B1.P9.26 47.62,7.62 v43.18,7.62 | U1.1 34.29,34.92 v35.56,33.66
  Bottom 0.254: v43.18,7.62 42.55,7.62 40.01,10.16 40.01,32.38 38.73,33.66 v35.56,33.66
GND  (via drill 0.35)  (37 unrouted)
  Top 0.305: v81.28,31.75 C1.2 80.96,34.92 79.38,34.92 79.1,34.65 U3.20 | 35.56,34.92 U1.2
  Bottom 0.813: v31.75,7.62 33.02,7.62 v34.29,6.35
  Bottom 1.016: v81.28,31.75 v81.28,29.21
  pour Top (isolate 0.254): 5.71,54.61 73.66,54.61 arc-90 86.36,41.91 86.36,12.7 arc-90 73.66,0 6.35,0 arc-90 0,6.35 0,20.95 20.32,20.95 20.32,38.73 5.71,38.73
I2C2_SCL  (via drill 0.35)
  Top 0.203: v53.98,38.73 R1.1 54.24,41.54 55.88,43.18 U2.3 60.33,43.18 61.59,44.45 71.75,44.45 v73.03,43.18 | U3.14 74.59,37.17 v74.3,37.47
  Bottom 0.203: B1.P9.19 43.18,2.54 44.45,3.81 44.45,5.08 52.07,13.34 52.07,36.83 v53.98,38.73 | v73.03,43.18 73.03,38.73 v74.3,37.47
I2C2_SDA  (via drill 0.35)
  Top 0.203: v55.24,40.01 57.15,41.91 60.33,41.91 61.59,43.18 U2.4 67.31,43.18 71.75,38.73 74.3,38.73 75.24,37.79 U3.15 75.24,32.08 76.83,30.48 82.55,30.48 83.82,31.75 R2.1
  Bottom 0.203: B1.P9.20 43.18,5.08 50.8,13.34 50.8,37.47 53.34,40.01 v55.24,40.01
N$1
  Top 0.406: U1.6 36.83,45.72 35.56,46.99 27.3,46.99 26.3,45.99 J1.2
N$2
  Top 0.406: U1.7 35.56,44.45 34.29,45.72 29.21,45.72 28.3,44.81 J1.3
N$3
  Top 1.27: R5.1 25.09,16.82 24.77,17.14 U8.1 22.84,20.3 21.59,19.05 R6.2
N$4
  Top 1.27: PAD1.1 14.72,15.24 D1.A
N$5  (4 unrouted)
PRU1_0
  Bottom 0.203: B1.P8.45 76.2,48.26 71.75,43.81 71.75,36.83 63.5,27.94 U2.16
PRU1_1
  Bottom 0.203: B1.P8.46 74.93,51.44 74.93,48.26 71.12,44.45 71.12,37.47 63.5,29.21 60.96,29.21 U2.15
PRU1_2
  Bottom 0.203: B1.P8.43 73.66,48.26 70.48,45.09 70.48,38.1 63.5,30.48 U2.14
PRU1_3
  Bottom 0.203: B1.P8.44 72.39,51.44 72.39,48.26 69.85,45.72 69.85,38.73 63.5,31.75 60.96,31.75 U2.13
PRU1_4
  Bottom 0.203: B1.P8.41 71.12,48.26 69.22,46.35 69.22,39.37 63.5,33.02 U2.12
PRU1_5
  Bottom 0.203: B1.P8.42 69.85,51.44 69.85,48.26 68.58,46.99 68.58,40.01 63.5,34.29 60.96,34.29 U2.11
PRU1_6
  Bottom 0.203: B1.P8.39 68.58,48.26 67.94,47.62 67.94,40.64 63.5,35.56 U2.10
PRU1_7
  Bottom 0.203: B1.P8.40 67.31,51.44 67.31,41.27 63.5,36.83 60.96,36.83 U2.9
PRU1_8
  Bottom 0.203: B1.P8.27 53.34,48.9 55.88,46.35 55.88,43.81 59.05,40.64 U2.5
PRU1_9
  Bottom 0.203: B1.P8.29 55.88,48.9 56.52,48.26 65.41,48.26 66.67,46.99 66.67,41.91 65.41,40.64 U2.6
PRU1_10
  Bottom 0.203: B1.P8.28 54.61,51.44 54.61,48.9 55.88,47.62 64.76,47.62 65.39,46.99 66.04,46.35 66.04,42.55 65.4,41.91 61.71,41.91 60.96,41.16 60.96,39.37 U2.7
PWDN
  Bottom 0.203: U2.17 59.05,25.4 57.78,26.67 57.78,40.64 55.24,43.18 55.24,45.72 52.07,48.9 52.07,51.44 B1.P8.26
RST  (via drill 0.35)
  Top 0.203: R4.1 C1.1 80.96,36.83 76.83,36.83 75.89,35.88 U3.16 75.89,32.7 v76.2,32.38 | JP1.2 52.07,39.37 52.07,38.1 53.34,36.83 55.88,36.83 58.42,34.29 69.22,34.29 v72.39,31.11
  Bottom 0.203: v72.39,31.11 75.56,31.11 76.2,31.75 v76.2,32.38
SYS_RESETN
  Top 0.203: U6.2 33.66,7.62 B1.P9.10
SYS_RESETN_5V
  Top 0.203: R3.2 54.61,34.92 57.78,31.75 67.94,31.75 69.22,30.48 69.22,20.95 70.78,19.39 74.58,19.39 | U7.1 74.58,19.39 | 74.58,19.39 75.56,18.41 75.56,8.26 74.3,6.99
  Top 0.254: U6.4 39.99,6.97 42.55,9.53 48.9,9.53 51.44,6.99 74.3,6.99
TEST  (via drill 0.35)
  Top 0.203: JP1.1 50.8,41.91 52.7,40.01 52.7,38.73 53.98,37.47 58.42,37.47 59.05,36.83 68.58,36.83 v75.56,29.84 | U3.17 76.54,33.31 76.83,33.02 77.47,33.02 v78.11,32.38
  Bottom 0.203: v75.56,29.84 77.47,29.84 78.11,30.48 v78.11,32.38
UART2_DIR  (via drill 0.35)
  Top 0.203: v55.88,27.94 SJ2.3
  Bottom 0.203: B1.P9.23 48.26,2.54 49.53,3.81 49.53,6.35 55.88,13.34 v55.88,27.94
UART2_RXD  (via drill 0.35)
  Top 0.203: SJ3.3 54.23,23.11 53.34,22.23 v53.34,20.95
  Bottom 0.203: B1.P9.22 45.72,5.08 53.34,13.34 v53.34,20.95
UART2_TXD  (via drill 0.35)
  Top 0.203: v55.88,31.11 55.24,31.75 SJ1.3
  Bottom 0.203: B1.P9.21 45.72,2.54 46.99,3.81 46.99,5.08 54.61,13.34 54.61,29.21 55.88,30.48 v55.88,31.11
UART_DYN_DIR
  Top 0.203: U4.1 47.3,39.7 48.26,38.73 48.26,36.83 | U5.1 47.32,35.89 48.26,36.83 | 48.26,36.83 48.26,32.38 50.8,29.84 51.44,29.84 52.7,28.57 SJ2.2
UART_DYN_RXD
  Top 0.203: SJ3.2 52.7,24.77 51.44,26.04 49.53,26.04 48.9,26.67 48.9,30.48 46.99,32.38 45.09,32.38 44.45,33.02 44.45,33.95 U5.4
UART_DYN_TXD
  Top 0.203: SJ1.2 52.7,33.02 52.07,33.66 49.53,33.66 48.9,34.29 48.9,39.37 46.99,41.27 45.72,41.27 45.09,40.64 U4.2
UART_MSP_DIR  (via drill 0.35)
  Top 0.203: SJ2.1 51.18,27.56 52.7,26.04 57.15,26.04 57.78,26.67 v64.14,26.67 | U3.8 73.94,41.55 v74.3,41.91
  Bottom 0.203: v64.14,26.67 64.77,26.67 67.94,29.84 73.03,35.56 75.56,35.56 77.47,37.47 77.47,41.27 76.83,41.91 v74.3,41.91
UART_MSP_RXD  (via drill 0.35)
  Top 0.203: v57.78,24.13 53.34,19.68 52.07,19.68 51.18,20.57 SJ3.1 | U3.3 77.19,39.02 v78.11,38.1
  Bottom 0.203: v57.78,24.13 63.5,24.13 73.66,34.92 76.2,34.92 78.11,36.83 v78.11,38.1
UART_MSP_TXD  (via drill 0.35)
  Top 0.203: SJ1.1 51.18,31.37 52.7,29.84 56.52,29.84 57.15,29.21 v66.04,29.21 | U3.4 76.54,37.8 v76.2,37.47
  Bottom 0.203: v66.04,29.21 72.39,36.2 74.93,36.2 v76.2,37.47
VIN  (3 unrouted)
VO  (4 unrouted)
VOUT  (1 unrouted)
XCLK  (via drill 0.35)
  Top 0.203: U2.8 61.48,38.1 60.21,39.37 v57.15,39.37
  Bottom 0.203: B1.P9.25 52.07,3.17 52.07,5.08 57.15,10.16 57.15,33.02 55.88,34.29 55.88,38.1 v57.15,39.37

### Text on the board
tPlace: P2 | 2 | 36 | 1 | 35 | 2 | 36 | 1 | 35 | P1
bPlace: BAT | PRU0 | 58 | 57 | 60 | 52 | PB | + | T | 47 | 64 | 46 | 44 | RST | 6 | 3 | 2 | 5 | A7(1.8) | 59 | PWM1A | 23 | RX | TX | SCL | SDA | VOUT | GND | 65 | 27 | GND | +3.3V | MOSI | MISO | CLK | CS1 | 45 | A5/86 | U4 | I2C1 | SPI1 | P2 | P1 | SPI0 | I2C2 | U0 | A6/87 | 89 | CS0 | CLK | MISO | MOSI | +3.3V | GND | A+ | 20 | GND | VOUT | SDA | SCL | TX | RX | 26 | PWM0A | VIN | P1.10 | EN | VB | VI | - | + | ID | GND | - | 0 | 1 | 2 | 3 | 4 | 7 | 4 | 1 | USB1 | AIN (1.8V) | PRU0
tNames: J1 | GND | GND | RST | TST | JP1 | SJ1 | SJ2 | SJ3 | MSP | BBB | 12V | GND | SD1714 / Localization Device Cape / 10/10/2017 Rev. 1.1 / Jacob Huesman
Document: Add holes for bolts
Reference: 75 Mils back--> / Try to move back 75 Mils <---